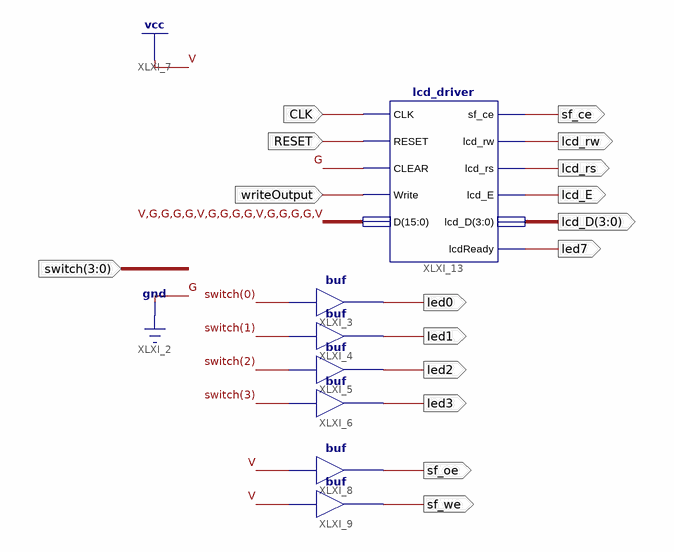
[diagram p0: schematic sheet 1]
// Xilinx ISE schematic io_block.sch (spartan3e) as structural Verilog: 7 symbols, 17 ports
module io_block (
  input  CLK,
  input  RESET,
  input  [3:0] switch,
  input  writeOutput,
  output sf_ce,
  output lcd_rw,
  output lcd_E,
  output lcd_rs,
  output [3:0] lcd_D,
  output led0,
  output led1,
  output led2,
  output led3,
  output V,
  output sf_oe,
  output sf_we,
  output led7
);

  buf XLXI_3 (led0, switch[0]);
  buf XLXI_4 (led1, switch[1]);
  buf XLXI_5 (led2, switch[2]);
  buf XLXI_6 (led3, switch[3]);
  buf XLXI_8 (sf_oe, 1'b1);
  buf XLXI_9 (sf_we, 1'b1);
  lcd_driver XLXI_13 (
    .CLK(CLK), .RESET(RESET), .CLEAR(1'b0), .Write(writeOutput), .D(16'b1000010000100001), .sf_ce(sf_ce),
    .lcd_rw(lcd_rw), .lcd_rs(lcd_rs), .lcd_D(lcd_D), .lcd_E(lcd_E), .lcdReady(led7));

  assign V = 1'b1;
endmodule
